# EAGLE design USB (EAGLE 5.07)
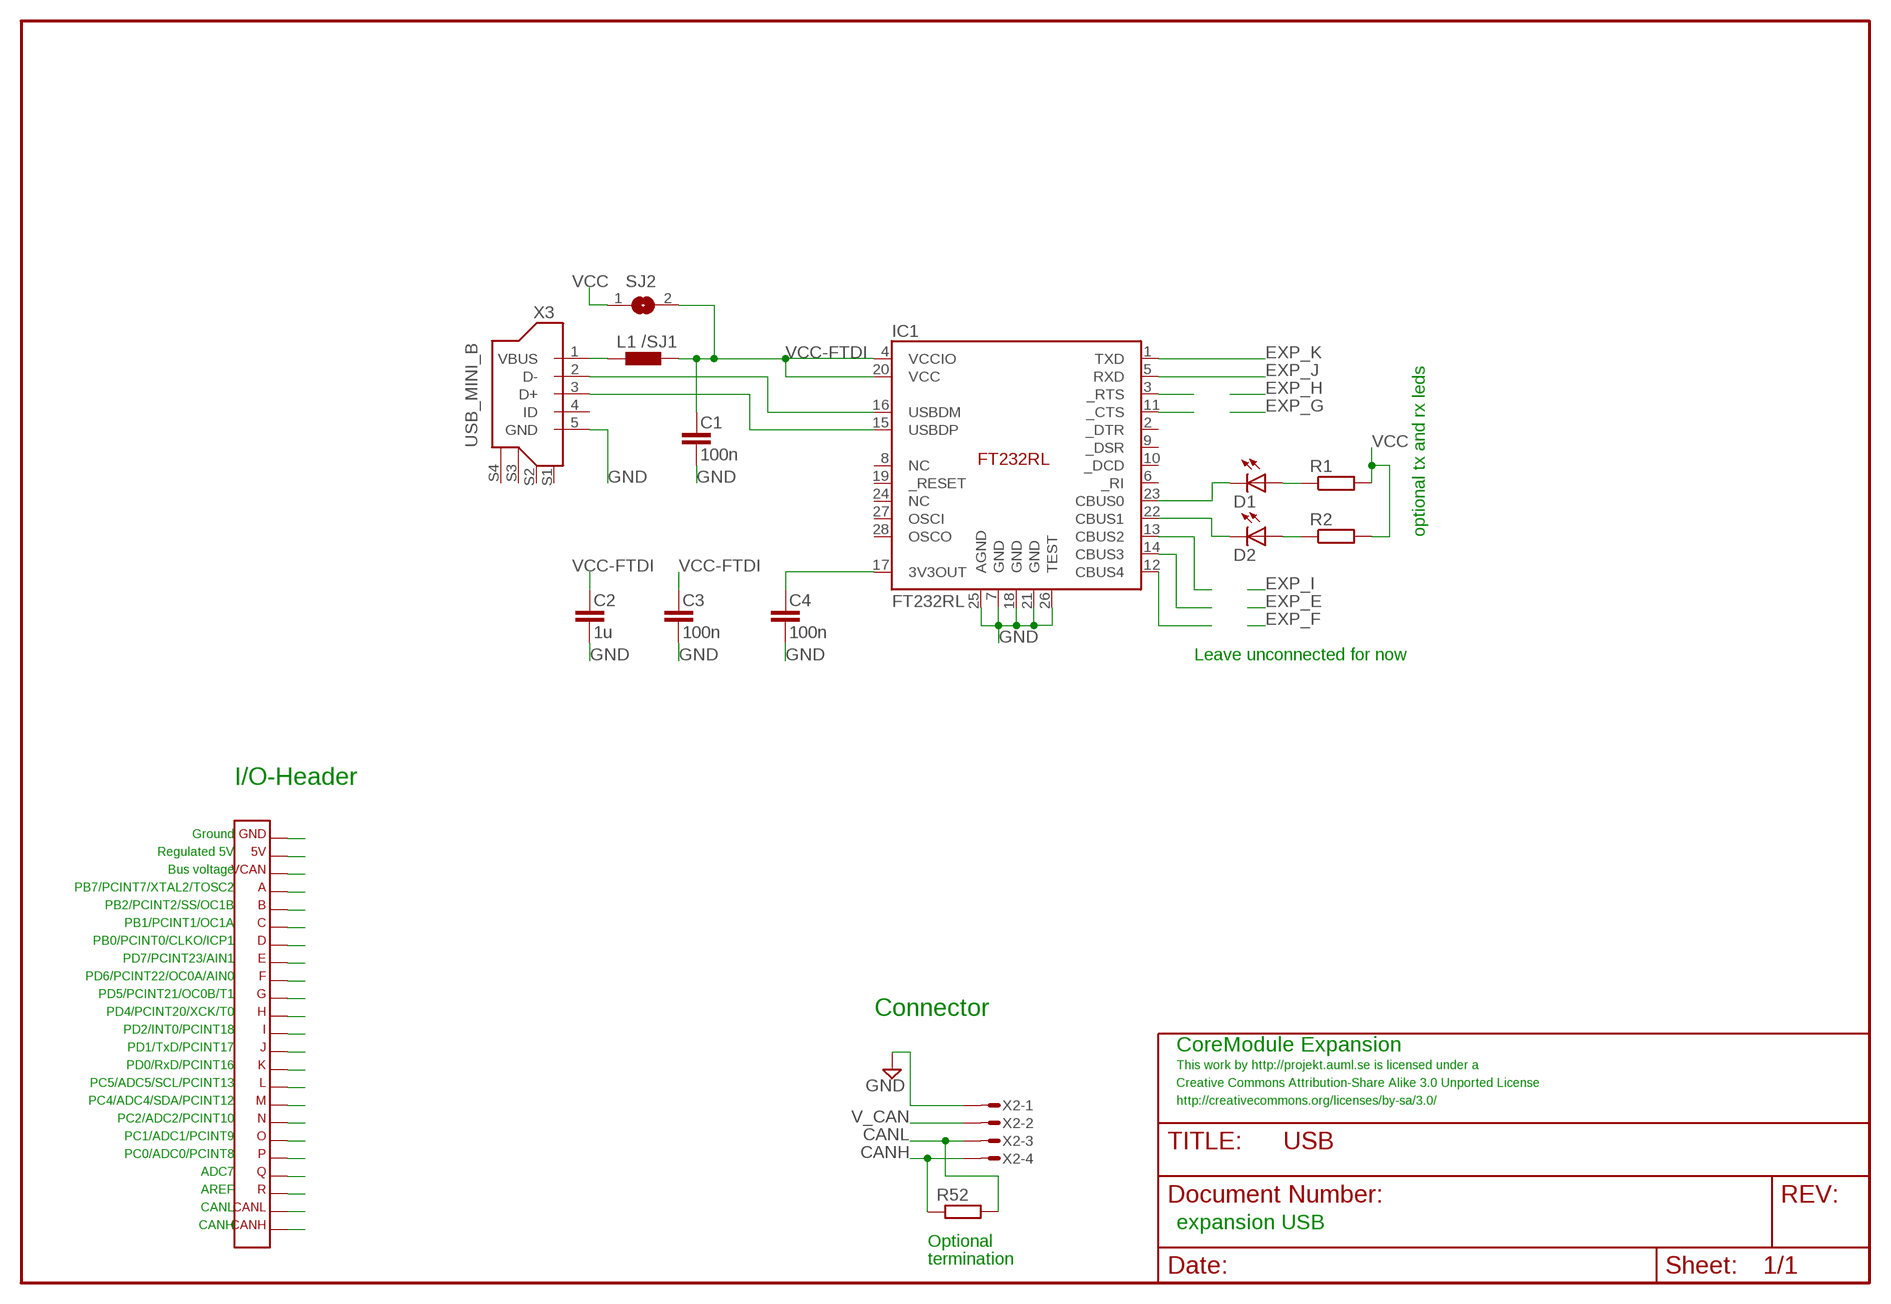
[diagram p0: schematic, sheet 1]

## Parts
C1  100n  C-EU  [C0603]
C2  1u  C-EU  [C0603]
C3  100n  C-EU  [C0603]
C4  100n  C-EU  [C0603]
D1  LED  [0603]
D2  LED  [0603]
IC1  FT232RL  [SSOP-28]
L1  L-EUL0603  [L0603]
R1  R-EUR0603  [R0603]
R2  R-EUR0603  [R0603]
R52  R-EUR0603  [R0603]
SJ2  SJ_NO  [SJ_NO]
X1  CORETWO_LAYOUTISPHOLES  [CORETWO_LAYOUT_ISPHOLES]
X2  MICROMATCH-4  [MICROMATCH-4]
X3  USB_MINI_B  [MOLEX67503]

## Nets
CANH: R52.1 X1.CANH X2.4
CANL: R52.2 X1.CANL X2.3
D+: IC1.15(USBDP) X3.3(D+)
D-: IC1.16(USBDM) X3.2(D-)
EXP_A: X1.A
EXP_B: X1.B
EXP_C: X1.C
EXP_D: X1.D
EXP_E: X1.E
EXP_F: X1.F
EXP_G: X1.G
EXP_H: X1.H
EXP_I: X1.I
EXP_J: IC1.5(RXD) X1.J
EXP_K: IC1.1(TXD) X1.K
EXP_L: X1.L
EXP_M: X1.M
EXP_N: X1.N
EXP_O: X1.O
EXP_P: X1.P
EXP_Q: X1.Q
EXP_R: X1.R
GND: C1.2 C2.2 C3.2 C4.2 IC1.7(GND) IC1.18(GND) IC1.21(GND) IC1.25(AGND) IC1.26(TEST) X1.GND X2.1 X3.5(GND)
N$1: IC1.13(CBUS2)
N$2: IC1.14(CBUS3)
N$3: C4.1 IC1.17(3V3OUT)
N$4: IC1.11(_CTS)
N$5: IC1.3(_RTS)
N$6: D1.C IC1.23(CBUS0)
N$7: D2.C IC1.22(CBUS1)
N$8: D1.A R1.1
N$9: D2.A R2.1
N$10: IC1.12(CBUS4)
V_CAN: X1.VCAN X2.2
VBUS: L1.1 X3.1(VBUS)
VCC: R1.2 R2.2 SJ2.1 X1.5V
VCC-FTDI: C1.1 C2.1 C3.1 IC1.4(VCCIO) IC1.20(VCC) L1.2 SJ2.2
Unconnected: IC1.2(_DTR) IC1.6(_RI) IC1.8(NC) IC1.9(_DSR) IC1.10(_DCD) IC1.19(_RESET) IC1.24(NC) IC1.27(OSCI) IC1.28(OSCO) X3.4(ID) X3.S1 X3.S2 X3.S3 X3.S4

## Notes on the sheet
- /SJ1
- optional tx and rx leds
- Leave unconnected for now
- I/O-Header
- Ground
- Regulated 5V
- Bus voltage
- PB7/PCINT7/XTAL2/TOSC2
- PB2/PCINT2/SS/OC1B
- PB1/PCINT1/OC1A
- PB0/PCINT0/CLKO/ICP1
- PD7/PCINT23/AIN1
- PD6/PCINT22/OC0A/AIN0
- PD5/PCINT21/OC0B/T1
- PD4/PCINT20/XCK/T0 | Connector
- PD2/INT0/PCINT18
- PD1/TxD/PCINT17 | CoreModule Expansion
- PD0/RxD/PCINT16 | This work by http://projekt.auml.se is licensed under a
- PC5/ADC5/SCL/PCINT13 | Creative Commons Attribution-Share Alike 3.0 Unported License
- PC4/ADC4/SDA/PCINT12 | http://creativecommons.org/licenses/by-sa/3.0/
- PC2/ADC2/PCINT10
- PC1/ADC1/PCINT9
- PC0/ADC0/PCINT8
- ADC7
- AREF
- CANL
- CANH | expansion USB
- Optional
- termination

## Library data of the parts
C1-C4 = rcl:C-EU
D1 D2 = led:LED
IC1 = ftdi4:FT232RL
L1 = rcl:L-EU
R1 R2 R52 = rcl:R-EU
SJ2 = jumper:SJ_NO
X1 = expboard:CORETWO_LAYOUT
X2 = con-amp-micromatch:MICROMATCH-4: MicroMaTch 4 7-215464-4 / 0-215464-4 Drawing Number C-215464 DDEController.pdf
X3 = usbminib:USB_MINI_B

## Board
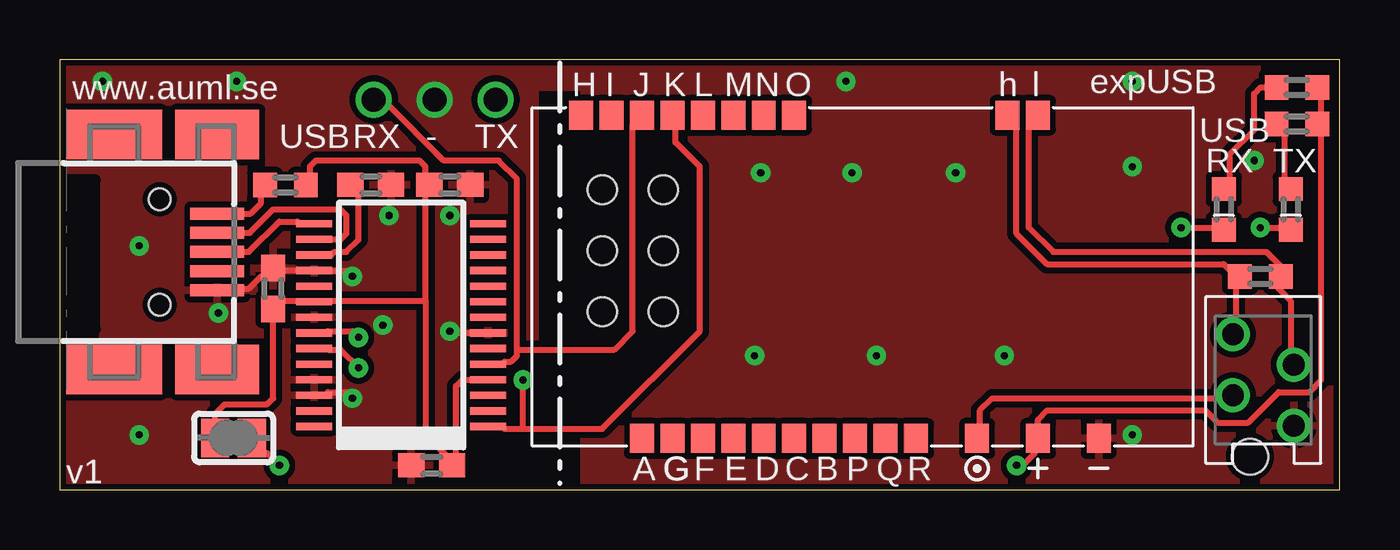
[diagram p1: board, top side]
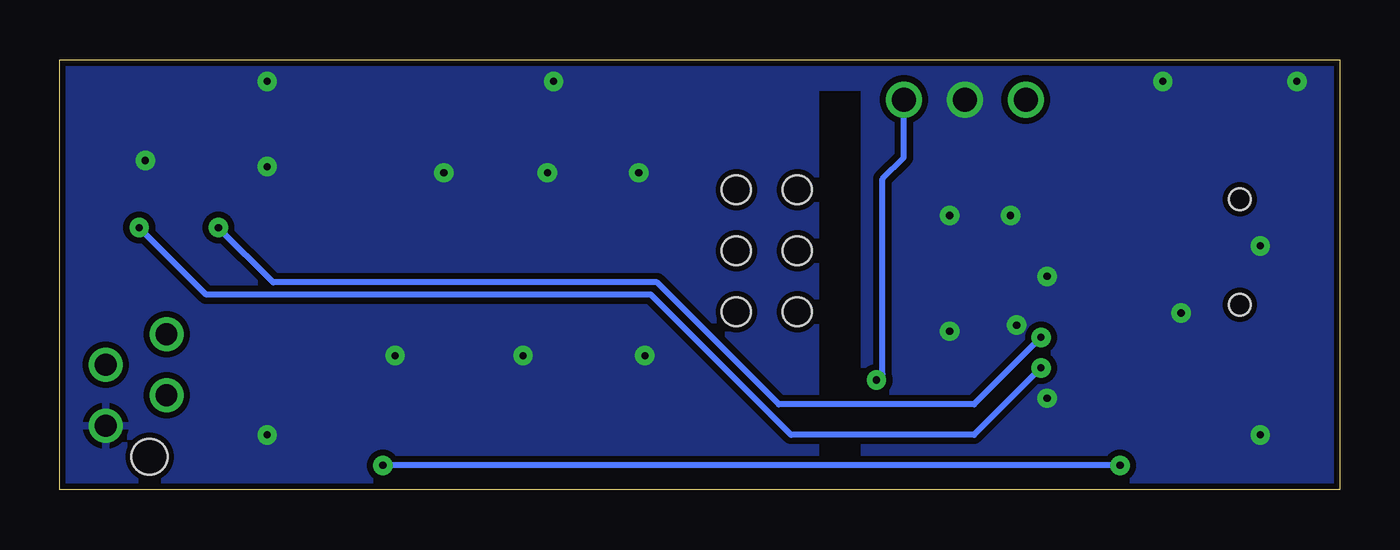
[diagram p2: board, bottom side, seen from below]

Size 53.34 x 17.91 mm. Coordinates in mm from the lower left corner, seen from the top.
Outline: 0,0 53.34,0 53.34,17.91 0,17.91 0,0
Copper layers (1*16): Top 0.035mm / dielectric 1.5mm / Bottom 0.035mm
Design rules "default": minimum track width 10mil, minimum drill 0.4mm, track to track 10mil, track to pad 10mil, pad to pad 10mil, via to via 10mil, smd to smd 8mil, copper to edge 10mil, drill to drill 8mil, minimum pad ring 10mil, minimum via ring 10mil, stop-mask expansion 4mil, vias tented up to drill 18mil, thermal gap 10mil

### Footprints (pad centres in the part's own frame; a part is rotated, then mirrored left to right if it is on the bottom)
C0603 = smd 1.1 x 1: 1 -0.85,0; 2 0.85,0
0603 = smd 0.991 x 1.016: A -0.85,0; C 0.85,0
SSOP-28 = smd 0.3 x 1.5: 1 -4.225,-3.625; 2 -3.575,-3.625; 3 -2.925,-3.625; 4 -2.275,-3.625; 5 -1.625,-3.625; 6 -0.975,-3.625; 7 -0.325,-3.625; 8 0.325,-3.625; 9 0.975,-3.625; 10 1.625,-3.625; 11 2.275,-3.625; 12 2.925,-3.625; 13 3.575,-3.625; 14 4.225,-3.625; 15 4.225,3.625; 16 3.575,3.625; 17 2.925,3.625; 18 2.275,3.625; 19 1.625,3.625; 20 0.975,3.625; 21 0.325,3.625; 22 -0.325,3.625; 23 -0.975,3.625; 24 -1.625,3.625; 25 -2.275,3.625; 26 -2.925,3.625; 27 -3.575,3.625; 28 -4.225,3.625
L0603 = smd 0.991 x 1.016: 1 -0.85,0; 2 0.85,0
R0603 = smd 0.991 x 1.016: 1 -0.85,0; 2 0.85,0
SJ_NO = smd 1.168 x 1.6: 1 -0.762,0; 2 0.762,0
CORETWO_LAYOUT_ISPHOLES = smd 1 x 1.2: 5V 17.78,0.362; A 1.27,0.362; B 8.89,0.362; C 7.62,0.362; CANH 16.51,13.824; CANL 17.78,13.824; D 6.35,0.362; E 5.08,0.362; F 3.81,0.362; G 2.54,0.362; GND 20.32,0.362; H -1.27,13.824; I 0,13.824; J 1.27,13.824; K 2.54,13.824; L 3.81,13.824; M 5.08,13.824; N 6.35,13.824; O 7.62,13.824; P 10.16,0.362; Q 11.43,0.362; R 12.7,0.362; VCAN 15.24,0.362 | hole 1.2: -0.381,10.719; 2.159,10.719; -0.381,8.179; -0.381,5.639; 2.159,8.179; 2.159,5.639
MICROMATCH-4 = drill 0.9 round: 1 1.905,1.27; 2 0.635,-1.27; 3 -0.635,1.27; 4 -1.905,-1.27 | hole 1.5: 3.199,-0.562
MOLEX67503 = smd 2.25 x 0.5: 1 6.3,1.6; 2 6.3,0.8; 3 6.3,0; 4 6.3,-0.8; 5 6.3,-1.6 | smd 3.5 x 2.05: S1 6.3,4.9; S2 6.3,-4.9 | smd 4 x 2.05: S3 2,4.9; S4 2,-4.9 | hole 0.9: 3.9,2.2; 3.9,-2.2

### Placement (x,y rotation side)
C1  8.89,8.38 90 top
C2  16.26,12.7 0 top
C3  15.49,1.02 180 top
C4  12.95,12.7 0 top
D1  51.31,11.68 270 top
D2  48.51,11.68 270 top
IC1  14.22,6.86 90 top
L1  9.4,12.7 0 top
R1  51.56,15.24 0 top
R2  51.56,16.76 0 top
R52  50.04,8.89 0 top
SJ2  7.24,2.16 180 top
X1  22.99,1.78 0 top
X2  50.16,4.57 270 top
X3  0.25,9.91 0 top

### Tracks (layer width: path | path; a pad name or v marks a point on that pad's centre or on a via)
CANH
  Top 0.254: X2.4 49.02,6.6 49.02,8.72 R52.1 49.02,8.89 48.51,9.4 41.15,9.4 39.88,10.67 39.88,15.22 X1.CANH
CANL
  Top 0.254: X2.3 51.44,5.46 51.31,5.59 51.31,7.87 50.8,8.38 50.8,8.8 R52.2 50.89,9.31 50.29,9.91 41.4,9.91 40.39,10.92 40.39,15.22 X1.CANL
D+
  Top 0.254: IC1.15 10,11.08 9.91,11.18 9.14,11.18 7.87,9.91 X3.3
D-
  Top 0.254: X3.2 7.91,10.71 8.89,11.68 11.68,11.68 11.94,11.43 11.94,10.67 11.68,10.41 10.62,10.41 IC1.16
EXP_J  (via drill 1)
  Top 0.254: IC1.5 18.44,5.23 18.54,5.33 18.8,5.33 19.05,5.59 19.05,5.84 | 19.05,5.84 23.11,5.84 23.88,6.6 23.88,15.22 X1.J | v13.08,16.26 13.59,16.13 16,13.72 18.29,13.72 19.05,12.95 19.05,5.84
EXP_K  (via drill 0.3, 1)
  Top 0.254: IC1.1 18.45,2.63 18.54,2.54 19.3,2.54 | 19.3,2.54 22.61,2.54 26.67,6.6 26.67,13.46 25.65,14.48 25.65,15.47 X1.K | 19.3,2.54 v19.3,4.57
  Bottom 0.254: v18.16,16.26 18.16,13.84 19.05,12.95 19.05,4.83 v19.3,4.57
GND  (via drill 0.3, 1)
  Top 0.254: X3.5 7.29,8.31 7.37,8.38 7.87,8.38 8.38,8.89 8.55,8.89 C1.2 9.06,9.23 9.14,9.14 10.59,9.14 IC1.18 12.18,9.13 12.19,9.14 | IC1.26 11.05,3.93 11.18,4.06 11.94,4.06 v12.19,3.81 | IC1.7 16.58,6.53 16.51,6.6
  other vias: 15.62,16.26 12.19,8.89 3.3,10.16 6.6,7.37 3.3,2.29 1.78,17.02 7.37,17.02 32.77,17.02 33.02,13.21 29.21,13.21 37.34,13.21 28.96,5.59 34.04,5.59 39.37,5.59 44.7,17.02 44.7,13.46 49.78,13.72 44.7,2.29 16.26,6.6 13.46,6.86 16.26,11.43 13.72,11.43
  pour Bottom (isolate 0.254, rank 3): 0,17.91 53.34,17.91 53.34,0 21.84,0 21.84,16.76 19.81,16.76 19.81,0 0,0
  pour Top (isolate 0.254, rank 3): 0,17.91 53.34,17.91 53.34,0 21.84,0 21.84,16.76 19.81,16.76 19.81,0 0,0
N$3
  Top 0.254: IC1.17 11.31,9.78 11.43,9.91 11.94,9.91 12.45,10.41 12.45,12.36 C4.1
N$6  (via drill 0.3)
  Top 0.254: IC1.23 11.13,5.88 11.18,5.84 11.68,5.84 v12.45,5.08 | v50.04,10.92 50.97,10.92 D1.C
  Bottom 0.254: v12.45,5.08 15.24,2.29 22.86,2.29 28.7,8.13 47.24,8.13 v50.04,10.92
N$7  (via drill 0.3)
  Top 0.254: IC1.22 11.11,6.53 11.18,6.6 12.19,6.6 v12.45,6.35 | v46.74,10.92 48.43,10.92 D2.C
  Bottom 0.254: v12.45,6.35 15.24,3.56 23.37,3.56 28.45,8.64 44.45,8.64 v46.74,10.92
N$8
  Top 0.254: D1.A 51.05,12.79 51.05,15.24 R1.1
N$9
  Top 0.254: D2.A 48.77,12.79 48.77,13.97 49.78,14.99 49.78,16.51 50.04,16.76 R2.1
V_CAN
  Top 0.254: X2.2 48.51,3.81 38.86,3.81 38.35,3.3 38.35,2.27 X1.VCAN
VBUS
  Top 0.254: X3.1 7.95,11.51 8.38,11.94 8.38,12.53 L1.1
VCC  (via drill 0.3)
  Top 0.254: SJ2.1 8,1.91 8.38,1.52 8.64,1.52 v9.14,1.02 | v39.88,1.02 40.13,1.02 40.64,1.52 40.64,2.01 X1.5V 40.77,2.92 41.15,3.3 47.75,3.3 48.26,2.79 49.53,2.79 50.8,4.06 52.07,4.06 52.58,4.57 52.58,15.24 | 52.58,15.24 R1.2 | 52.58,15.24 52.58,16.6 R2.2
  Bottom 0.254: v9.14,1.02 v39.88,1.02
VCC-FTDI
  Top 0.254: L1.2 10.25,12.79 10.41,12.95 10.41,13.46 10.67,13.72 14.99,13.72 15.24,13.46 15.24,12.87 C2.1 15.24,12.61 15.24,7.87 | 15.24,7.87 11.18,7.87 11.13,7.83 IC1.20 10.56,7.87 9.14,7.87 8.89,7.62 C1.1 8.89,3.81 8.64,3.56 6.86,3.56 6.48,3.17 SJ2.2 | 15.24,7.87 15.24,2.29 16.34,1.18 C3.1 16.51,1.1 16.51,4.32 16.77,4.58 IC1.4

### Text on the board
tPlace: expUSB | www.auml.se | USB | RX | - | TX | USB | RX | TX | v1
Document: Creative Commons Attribution-Share Alike 3.0 Unported License | This work by http://projekt.auml.se is licensed under a | http://creativecommons.org/licenses/by-sa/3.0/